# EasyEDA Pro project slimarm_apricot-r_b_v1r3.eprj, board PCB1
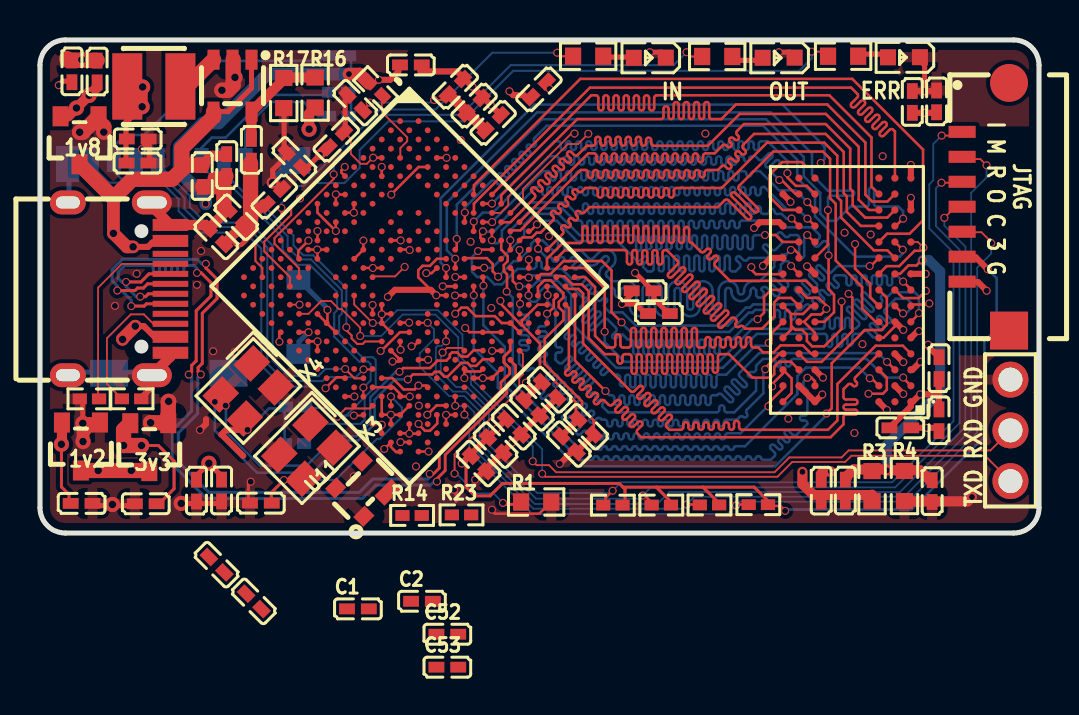
[diagram p1: board, top side]
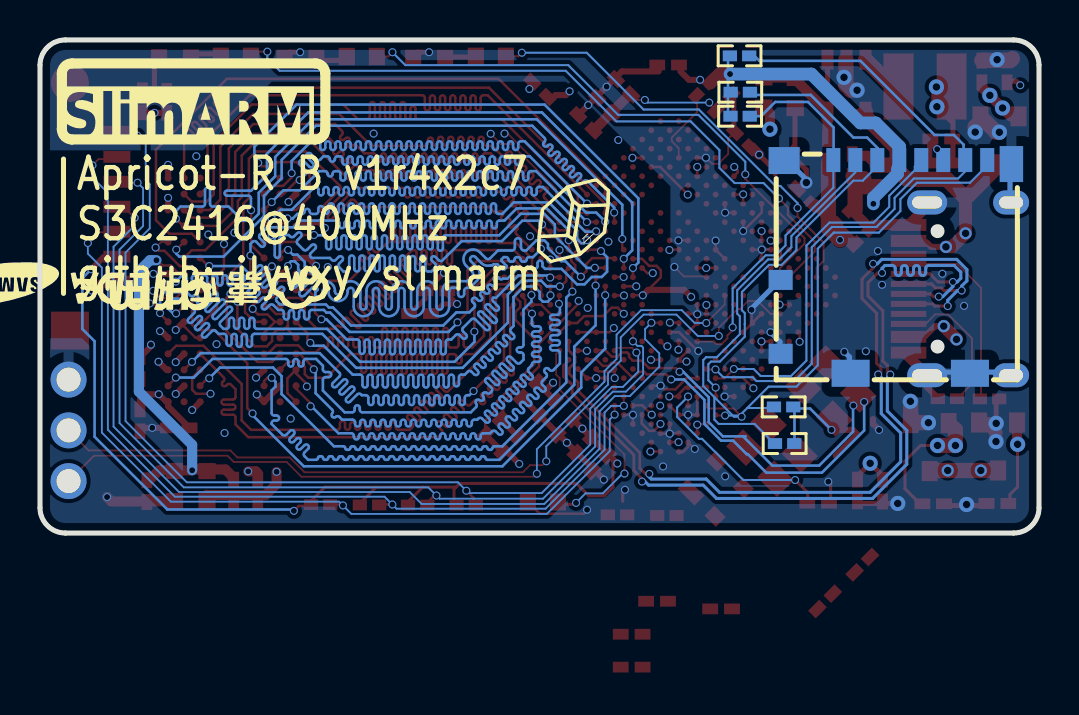
[diagram p2: board, bottom side, seen from below]

Outline 49.98 x 24.69 mm; copper layers: Top Layer, Inner1, Inner2, Bottom Layer. Coordinates in mm from the lower left corner of the outline.
Outline path: 0,23.42 0,1.27 arc(0.37,0.37) 1.27,0 48.71,0 arc(49.61,0.37) 49.98,1.27 49.98,23.42 arc(49.61,24.32) 48.71,24.69 1.27,24.69 arc(0.37,24.32) 0,23.42
Stack: Top Layer 0.035mm / Dielectric1 0.347mm PP er 4.5 / Inner1 0.035mm / Dielectric2 0.347mm FR4 er 4.5 / Inner2 0.035mm / Dielectric3 0.347mm PP er 4.5 / Bottom Layer 0.035mm

## Design rules (mm)
net DDR_CLKN: DDRCLK
net DDR_CLKP: DDRCLK
net USB_DN: USB
net USB_DP: USB
template: 自定义配置
spacing copperThickness1oz (default): track to track 0.089, other pairs 0.089 to 0.3
spacing copperThickness2oz: track to track 0.203, other pairs 0.152 to 0.3
track width copperThickness1oz (default): min 0.089, default 0.089, max 2.54
track width copperThickness2oz: min 0.089, default 0.089, max 2.54
differential pair DDRCLK (default): width min 0.089, default 0.127, max 2.54; gap min 0.203, default 0.203
differential pair USB: width min 0.142, default 0.142, max 2.54; gap min 0.152, default 0.152
via viaSize (default): diameter min 0.399, default 0.399, max 10; hole min 0.3, default 0.3, max 6.299
net DDR_D14 uses DDR
net DDR_D12 uses DDR
net DDR_D6 uses DDR
net DDR_D9 uses DDR
net DDR_D1 uses DDR
net DDR_A14_BA0 uses DDR
net DDR_A10 uses DDR
net DDR_A3 uses DDR
net DDR_A7 uses DDR
net DDR_A12 uses DDR
net DDR_D11 uses DDR
net DDR_D3 uses DDR
net DDR_A15_BA1 uses DDR
net DDR_A1 uses DDR
net DDR_A5 uses DDR
net DDR_A9 uses DDR
net DDR_D10 uses DDR
net DDR_D2 uses DDR
net DDR_A2 uses DDR
net DDR_A6 uses DDR
net DDR_A11 uses DDR
net DDR_D8 uses DDR
net DDR_D0 uses DDR
net DDR_A0 uses DDR
net DDR_A4 uses DDR
net DDR_A8 uses DDR
net DDR_D15 uses DDR
net DDR_D13 uses DDR
net DDR_D7 uses DDR
net DDR_D5 uses DDR
net DDR_RAS uses DDR
net DDR_UDQS uses DDR
net DDR_CS uses DDR
net DDR_CLKN uses DDR
net DDR_WE uses DDR
net DDR_D4 uses DDR
net DDR_LDQS uses DDR
net DDR_UDQM uses DDR
net DDR_SCKE uses DDR
net DDR_LDQM uses DDR
net DDR_CLKP uses DDR
net DDR_CAS uses DDR
net USB_DN uses USB
net USB_DP uses USB
diff pair USB uses USB
eq len grp DDR uses DDR
pour e13763 uses copperRegion1
pour e852 uses copperRegion1
pour e5968 uses copperRegion2

## Placement (name value [footprint] x y rotation side)
C1  13pF  [C0402]  15.91 -3.8 0 top
C2  13pF  [C0402]  19.11 -3.42 0 top
C3  100nF  [C0402]  44.64 2.1 90 top
C4  100nF  [C0402]  40.29 2.13 90 top
C5  100nF  [C0402]  7.83 2.13 270 top
C6  100nF  [C0402]  5.29 1.47 180 top
C9  100nF  [C0402]  1.6 23.12 90 top
C10  100nF  [C0402]  2.86 23.11 90 top
C11  100nF  [C0402]  9.09 2.13 270 top
C12  100nF  [C0402]  2.08 1.49 0 top
C13  100nF  [C0402]  14.83 19.7 45 top
C14  100nF  [C0402]  20.78 22.35 45 top
C15  100nF  [C0402]  11.72 16.84 45 top
C17  100nF  [C0402]  15.77 21.55 135 top
C18  100nF  [C0402]  12.73 18.68 135 top
C19  100nF  [C0402]  9.82 15.81 135 top
C20  100nF  [C0402]  8.82 14.85 135 top
C22  100nF  [C0402]  30.97 10.99 0 top
C23  100nF  [C0402]  30.15 12.13 0 top
C24  100nF  [C0402]  24.97 22.21 45 top
C25  100nF  [C0402]  26.46 4.45 315 top
C26  100nF  [C0402]  27.32 5.32 315 top
C27  100nF  [C0402]  22.67 20.54 45 top
C28  100nF  [C0402]  21.72 21.4 45 top
C30  100nF  [C0402]  21.95 3.48 315 top
C31  100nF  [C0402]  23.7 5.32 315 top
C32  100nF  [C0402]  8.84 -1.58 135 top
C33  100nF  [C0402]  22.8 4.4 315 top
C34  100nF  [C0402]  10.7 -3.42 315 top
C35  100nF  [C0402]  25.5 7.17 315 top
C36  100nF  [C0402]  24.62 6.27 315 top
C37  100nF  [C0402]  43.64 21.58 90 top
C38  100nF  [C0402]  44.86 21.61 90 top
C39  100nF  [C0402]  39.09 2.12 90 top
C40  100nF  [C0402]  43.04 5.27 0 top
C41  100nF  [C0402]  44.98 5.65 270 top
C42  100nF  [C0402]  44.98 8.26 90 top
C43  100nF  [C0402]  18.56 23.44 0 top
C45  100nF  [C0402]  11.05 1.5 180 top
C47  100nF  [C0402]  4.88 18.53 0 top
C48  100nF  [C0402]  4.89 19.73 0 top
C49  100nF  [C0402]  9.34 18.42 270 top
C50  100nF  [C0402]  8.12 17.88 270 top
C51  100nF  [C0402]  10.58 19.19 90 top
C52  13pF  [C0402]  20.38 -5.06 0 top
C53  13pF  [C0402]  20.38 -6.72 0 top
CN1  AFC12-S07DCA-00  [conn-smd_afc12-s07dca-00]  47.55 16.34 90 top
H1  2.54-1*3P针  [hdr-th_3p-p2.54-v-m-1]  48.55 5.14 270 top
L1  2.2uH  [IND-SMD_L3.0-W3.0]  5.7 22.36 180 top
LED1  NCD0603R1  [LED0603-RD_RED]  36.96 23.8 180 top
LED2  NCD0603R1  [LED0603-RD_RED]  30.51 23.8 180 top
LED3  NCD0603R1  [LED0603-RD_RED]  43.22 23.82 180 top
R1  44.2Ω  [R0603]  24.83 1.55 0 top
R3  2kΩ  [R0603]  41.63 2.35 270 top
R4  2kΩ  [R0603]  43.25 2.35 90 top
R5  1kΩ  [R0603]  33.88 23.86 0 top
R6  1kΩ  [R0603]  27.43 23.87 0 top
R7  1kΩ  [R0603]  40.18 23.87 0 top
R8  5.1kΩ  [R0402]  2.47 6.72 0 top
R9  5.1kΩ  [R0402]  4.58 6.72 180 top
R10  10kΩ  [R0402]  28.66 1.4 0 top
R11  10kΩ  [R0402]  33.5 1.41 0 top
R12  10kΩ  [R0402]  31.09 1.4 0 top
R13  5.1kΩ  [R0402]  35.94 1.42 0 top
R14  5.1kΩ  [R0402]  18.62 0.88 0 top
R15  5.1kΩ  [R0402]  16.8 22.25 135 top
R16  44.2Ω  [R0603]  13.77 22.05 90 top
R17  44.2Ω  [R0603]  12.2 22.03 270 top
R18  5.1kΩ  [R0402]  14.94 22.07 0 bottom
R19  5.1kΩ  [R0402]  12.78 6.32 180 bottom
R20  5.1kΩ  [R0402]  14.98 23.89 0 bottom
R21  5.1kΩ  [R0402]  12.73 4.48 180 bottom
R22  5.1kΩ  [R0402]  14.95 20.87 0 bottom
R23  5.1kΩ  [R0402]  21.09 0.91 0 top
SIM1  1040310811  [SIM-SMD_8P-1040310811]  7.15 13.34 0 bottom
U1  S3C2416_SCH  [S3C2416-XH40]  18.48 12.35 315 top
U4  NT5TU32M16FG-AC  [VFBGA-84_L7.5-W12.2-P0.80-TL_NANYA_NT5TU32M16FG]  40.37 12.17 180 top
U6  XC6206-3.3V  [SSOT-3_L2.9-W1.6-P0.95-LS2.8-BR]  5.47 4.3 90 top
U8  XC6206-3.3V  [SSOT-3_L2.9-W1.6-P0.95-LS2.8-BR]  1.98 19.67 90 top
U9  XC6206-3.3V  [SSOT-3_L2.9-W1.6-P0.95-LS2.8-BR]  2.05 4.33 90 top
U10  SY8089AAAC  [SOT-23-5_L3.0-W1.7-P0.95-LS2.8-BR]  9.63 22.4 90 top
U11  MAX811R  [SOT-143R_L2.9-W1.3-P1.92-LS2.3-BL]  16.17 2.22 45 top
USB2  TYPE-C 16PIN 2MD(073)  [USB-C-SMD_TYPE-C-6PIN-2MD-073]  3.77 12.23 270 top
X3  12MHz  [CRYSTAL-SMD_4P-L3.2-W2.5-BL]  13.36 4.1 225 top
X4  12MHz  [CRYSTAL-SMD_4P-L3.2-W2.5-BL]  10.42 7.11 225 top

## Footprints (pads in the part's own frame, mm; a bottom-side part is the same pattern mirrored in y, then rotated)
C0402
  rect 0.79x0.54 smd: 1(-0.545,0) 2(0.545,0)
conn-smd_afc12-s07dca-00
  rect 0.6x1.35 smd: 1(3.75,1.417) 2(2.5,1.417) 3(1.25,1.417) 4(0,1.417) 5(-1.25,1.417) 6(-2.5,1.417) 7(-3.75,1.417)
  rect 1.9x1.9 smd: 8(-6.2,-0.931)
  rrect 1.9x1.9 smd: 9(6.2,-0.931)
CRYSTAL-SMD_4P-L3.2-W2.5-BL
  rect 1.4x1.2 smd: 1(-1.1,-0.85) 2(1.1,-0.85) 3(1.1,0.85) 4(-1.1,0.85)
hdr-th_3p-p2.54-v-m-1
  round 1.8 hole 1.2: 1(-2.54,0) 2(0,0) 3(2.54,0)
IND-SMD_L3.0-W3.0
  rect 1.5x3.32 smd: 1(1.328,0) 2(-1.328,0)
LED0603-RD_RED
  rect 0.8x0.8 smd: 1(-0.799,-0.004) 2(0.799,0.004)
R0402
  rect 0.711x0.54 smd: 1(-0.482,0) 2(0.482,0)
R0603
  rect 0.806x0.864 smd: 1(-0.753,0) 2(0.753,0)
S3C2416-XH40
  round 0.29 smd: A2(-5.525,6.175) A3(-4.875,6.175) A4(-4.225,6.175) A5(-3.575,6.175) A6(-2.925,6.175) A7(-2.275,6.175) A8(-1.625,6.175) A9(-0.975,6.175) A10(-0.325,6.175) A11(0.325,6.175) A12(0.975,6.175) A13(1.625,6.175) A14(2.275,6.175) A15(2.925,6.175) A16(3.575,6.175) A17(4.225,6.175) A18(4.875,6.175) A19(5.525,6.175) B1(-6.175,5.525) B2(-5.525,5.525) B3(-4.875,5.525) B4(-4.225,5.525) B5(-3.575,5.525) B6(-2.925,5.525) B7(-2.275,5.525) B8(-1.625,5.525) B9(-0.975,5.525) B10(-0.325,5.525) B11(0.325,5.525) B12(0.975,5.525) B13(1.625,5.525) B14(2.275,5.525) B15(2.925,5.525) B16(3.575,5.525) B17(4.225,5.525) B18(4.875,5.525) B19(5.525,5.525) B20(6.175,5.525) C1(-6.175,4.875) C2(-5.525,4.875) C3(-4.875,4.875) C4(-4.225,4.875) C5(-3.575,4.875) C6(-2.925,4.875) C7(-2.275,4.875) C8(-1.625,4.875) C9(-0.975,4.875) C10(-0.325,4.875) C11(0.325,4.875) C12(0.975,4.875) C13(1.625,4.875) C14(2.275,4.875) C15(2.925,4.875) C16(3.575,4.875) C17(4.225,4.875) C18(4.875,4.875) C19(5.525,4.875) C20(6.175,4.875) D1(-6.175,4.225) D2(-5.525,4.225) D3(-4.875,4.225) D4(-4.225,4.225) D5(-3.575,4.225) D6(-2.925,4.225) D7(-2.275,4.225) D8(-1.625,4.225) D9(-0.975,4.225) D10(-0.325,4.225) D11(0.325,4.225) D12(0.975,4.225) D13(1.625,4.225) D14(2.275,4.225) D15(2.925,4.225) D16(3.575,4.225) D17(4.225,4.225) D18(4.875,4.225) D19(5.525,4.225) D20(6.175,4.225) E1(-6.175,3.575) E2(-5.525,3.575) E3(-4.875,3.575) E4(-4.225,3.575) E17(4.225,3.575) E18(4.875,3.575) E19(5.525,3.575) E20(6.175,3.575) F1(-6.175,2.925) F2(-5.525,2.925) F3(-4.875,2.925) F4(-4.225,2.925) F7(-2.275,2.925) F8(-1.625,2.925) F9(-0.975,2.925) F10(-0.325,2.925) F11(0.325,2.925) F12(0.975,2.925) F13(1.625,2.925) F14(2.275,2.925) F17(4.225,2.925) F18(4.875,2.925) F19(5.525,2.925) F20(6.175,2.925) G1(-6.175,2.275) G2(-5.525,2.275) G3(-4.875,2.275) G4(-4.225,2.275) G6(-2.925,2.275) G8(-1.625,2.275) G9(-0.975,2.275) G10(-0.325,2.275) G11(0.325,2.275) G12(0.975,2.275) G13(1.625,2.275) G14(2.275,2.275) G15(2.925,2.275) G17(4.225,2.275) G18(4.875,2.275) G19(5.525,2.275) G20(6.175,2.275) H1(-6.175,1.625) H2(-5.525,1.625) H3(-4.875,1.625) H4(-4.225,1.625) H6(-2.925,1.625) H7(-2.275,1.625) H8(-1.625,1.625) H9(-0.975,1.625) H10(-0.325,1.625) H11(0.325,1.625) H12(0.975,1.625) H13(1.625,1.625) H14(2.275,1.625) H15(2.925,1.625) H17(4.225,1.625) H18(4.875,1.625) H19(5.525,1.625) H20(6.175,1.625) J1(-6.175,0.975) J2(-5.525,0.975) J3(-4.875,0.975) J4(-4.225,0.975) J6(-2.925,0.975) J7(-2.275,0.975) J8(-1.625,0.975) J13(1.625,0.975) J14(2.275,0.975) J15(2.925,0.975) J17(4.225,0.975) J18(4.875,0.975) J19(5.525,0.975) J20(6.175,0.975) K1(-6.175,0.325) K2(-5.525,0.325) K3(-4.875,0.325) K4(-4.225,0.325) K6(-2.925,0.325) K7(-2.275,0.325) K8(-1.625,0.325) K13(1.625,0.325) K14(2.275,0.325) K15(2.925,0.325) K17(4.225,0.325) K18(4.875,0.325) K19(5.525,0.325) K20(6.175,0.325) L1(-6.175,-0.325) L2(-5.525,-0.325) L3(-4.875,-0.325) L4(-4.225,-0.325) L6(-2.925,-0.325) L7(-2.275,-0.325) L8(-1.625,-0.325) L13(1.625,-0.325) L14(2.275,-0.325) L15(2.925,-0.325) L17(4.225,-0.325) L18(4.875,-0.325) L19(5.525,-0.325) L20(6.175,-0.325) M1(-6.175,-0.975) M2(-5.525,-0.975) M3(-4.875,-0.975) M4(-4.225,-0.975) M6(-2.925,-0.975) M7(-2.275,-0.975) M8(-1.625,-0.975) M13(1.625,-0.975) M14(2.275,-0.975) M15(2.925,-0.975) M17(4.225,-0.975) M18(4.875,-0.975) M19(5.525,-0.975) M20(6.175,-0.975) N1(-6.175,-1.625) N2(-5.525,-1.625) N3(-4.875,-1.625) N4(-4.225,-1.625) N6(-2.925,-1.625) N7(-2.275,-1.625) N8(-1.625,-1.625) N9(-0.975,-1.625) N10(-0.325,-1.625) N11(0.325,-1.625) N12(0.975,-1.625) N13(1.625,-1.625) N14(2.275,-1.625) N15(2.925,-1.625) N17(4.225,-1.625) N18(4.875,-1.625) N19(5.525,-1.625) N20(6.175,-1.625) P1(-6.175,-2.275) P2(-5.525,-2.275) P3(-4.875,-2.275) P4(-4.225,-2.275) P6(-2.925,-2.275) P7(-2.275,-2.275) P8(-1.625,-2.275) P9(-0.975,-2.275) P10(-0.325,-2.275) P11(0.325,-2.275) P12(0.975,-2.275) P13(1.625,-2.275) P15(2.925,-2.275) P17(4.225,-2.275) P18(4.875,-2.275) P19(5.525,-2.275) P20(6.175,-2.275) R1(-6.175,-2.925) R2(-5.525,-2.925) R3(-4.875,-2.925) R4(-4.225,-2.925) R7(-2.275,-2.925) R8(-1.625,-2.925) R9(-0.975,-2.925) R10(-0.325,-2.925) R11(0.325,-2.925) R12(0.975,-2.925) R13(1.625,-2.925) R14(2.275,-2.925) R17(4.225,-2.925) R18(4.875,-2.925) R19(5.525,-2.925) R20(6.175,-2.925) T1(-6.175,-3.575) T2(-5.525,-3.575) T3(-4.875,-3.575) T4(-4.225,-3.575) T17(4.225,-3.575) T18(4.875,-3.575) T19(5.525,-3.575) T20(6.175,-3.575) U1(-6.175,-4.225) U2(-5.525,-4.225) U3(-4.875,-4.225) U4(-4.225,-4.225) U5(-3.575,-4.225) U6(-2.925,-4.225) U7(-2.275,-4.225) U8(-1.625,-4.225) U9(-0.975,-4.225) U10(-0.325,-4.225) U11(0.325,-4.225) U12(0.975,-4.225) U13(1.625,-4.225) U14(2.275,-4.225) U15(2.925,-4.225) U16(3.575,-4.225) U17(4.225,-4.225) U18(4.875,-4.225) U19(5.525,-4.225) U20(6.175,-4.225) V1(-6.175,-4.875) V2(-5.525,-4.875) V3(-4.875,-4.875) V4(-4.225,-4.875) V5(-3.575,-4.875) V6(-2.925,-4.875) V7(-2.275,-4.875) V8(-1.625,-4.875) V9(-0.975,-4.875) V10(-0.325,-4.875) V11(0.325,-4.875) V12(0.975,-4.875) V13(1.625,-4.875) V14(2.275,-4.875) V15(2.925,-4.875) V16(3.575,-4.875) V17(4.225,-4.875) V18(4.875,-4.875) V19(5.525,-4.875) V20(6.175,-4.875) W1(-6.175,-5.525) W2(-5.525,-5.525) W3(-4.875,-5.525) W4(-4.225,-5.525) W5(-3.575,-5.525) W6(-2.925,-5.525) W7(-2.275,-5.525) W8(-1.625,-5.525) W9(-0.975,-5.525) W10(-0.325,-5.525) W11(0.325,-5.525) W12(0.975,-5.525) W13(1.625,-5.525) W14(2.275,-5.525) W15(2.925,-5.525) W16(3.575,-5.525) W17(4.225,-5.525) W18(4.875,-5.525) W19(5.525,-5.525) W20(6.175,-5.525) Y2(-5.525,-6.175) Y3(-4.875,-6.175) Y4(-4.225,-6.175) Y5(-3.575,-6.175) Y6(-2.925,-6.175) Y7(-2.275,-6.175) Y8(-1.625,-6.175) Y9(-0.975,-6.175) Y10(-0.325,-6.175) Y11(0.325,-6.175) Y12(0.975,-6.175) Y13(1.625,-6.175) Y14(2.275,-6.175) Y15(2.925,-6.175) Y16(3.575,-6.175) Y17(4.225,-6.175) Y18(4.875,-6.175) Y19(5.525,-6.175)
SIM-SMD_8P-1040310811
  rect 0.7x1.2 smd: 1(3.138,-5.338) 2(2.038,-5.338) 3(0.938,-5.338) 4(-0.163,-5.338) 5(-1.262,-5.338) 6(-2.362,-5.338) 7(-3.462,-5.338) 8(-4.562,-5.338)
  rect 1.17x1.8 smd: 9(-5.772,-5.138)
  rect 1.55x1.35 smd: 10(5.598,-5.312)
  rect 1.2x1 smd: 11(5.772,0.662) 12(5.772,4.362)
  rect 1.9x1.35 smd: 13(2.272,5.338) 14(-3.697,5.338)
SOT-23-5_L3.0-W1.7-P0.95-LS2.8-BR
  rect 1x0.6 smd: 1(1.3,-0.95) 2(1.3,0) 3(1.3,0.95) 4(-1.3,0.95) 5(-1.3,-0.95)
SOT-143R_L2.9-W1.3-P1.92-LS2.3-BL
  rect 0.8x0.7 smd: 1(-0.95,-1) 3(0.95,1) 4(-0.95,1)
  rect 1.2x0.7 smd: 2(0.75,-1)
SSOT-3_L2.9-W1.6-P0.95-LS2.8-BR
  rect 1x0.8 smd: 1(1.2,-0.95) 2(1.2,0.95) 3(-1.2,0)
USB-C-SMD_TYPE-C-6PIN-2MD-073
  rect 0.6x1.778 smd: 1(-3.2,2.756) 2(-2.4,2.756) 11(2.4,2.756) 12(3.2,2.756)
  rect 0.3x1.778 smd: 3(-1.75,2.756) 4(-1.25,2.756) 5(-0.75,2.756) 6(-0.25,2.756) 7(0.25,2.756) 8(0.75,2.756) 9(1.25,2.756) 10(1.75,2.756)
  oval 1.2x2 hole 0.6x1.5: 13(-4.325,1.825) 14(4.325,1.825)
  oval 1.2x1.8 hole 0.6x1.2: 13(-4.325,-2.375) 14(4.325,-2.375)
VFBGA-84_L7.5-W12.2-P0.80-TL_NANYA_NT5TU32M16FG
  round 0.36 smd: A1(-3.2,5.6) A2(-2.4,5.6) A3(-1.6,5.6) A7(1.6,5.6) A8(2.4,5.6) A9(3.2,5.6) B1(-3.2,4.8) B2(-2.4,4.8) B3(-1.6,4.8) B7(1.6,4.8) B8(2.4,4.8) B9(3.2,4.8) C1(-3.2,4) C2(-2.4,4) C3(-1.6,4) C7(1.6,4) C8(2.4,4) C9(3.2,4) D1(-3.2,3.2) D2(-2.4,3.2) D3(-1.6,3.2) D7(1.6,3.2) D8(2.4,3.2) D9(3.2,3.2) E1(-3.2,2.4) E2(-2.4,2.4) E3(-1.6,2.4) E7(1.6,2.4) E8(2.4,2.4) E9(3.2,2.4) F1(-3.2,1.6) F2(-2.4,1.6) F3(-1.6,1.6) F7(1.6,1.6) F8(2.4,1.6) F9(3.2,1.6) G1(-3.2,0.8) G2(-2.4,0.8) G3(-1.6,0.8) G7(1.6,0.8) G8(2.4,0.8) G9(3.2,0.8) H1(-3.2,0) H2(-2.4,0) H3(-1.6,0) H7(1.6,0) H8(2.4,0) H9(3.2,0) J1(-3.2,-0.8) J2(-2.4,-0.8) J3(-1.6,-0.8) J7(1.6,-0.8) J8(2.4,-0.8) J9(3.2,-0.8) K2(-2.4,-1.6) K3(-1.6,-1.6) K7(1.6,-1.6) K8(2.4,-1.6) K9(3.2,-1.6) L1(-3.2,-2.4) L2(-2.4,-2.4) L3(-1.6,-2.4) L7(1.6,-2.4) L8(2.4,-2.4) M2(-2.4,-3.2) M3(-1.6,-3.2) M7(1.6,-3.2) M8(2.4,-3.2) M9(3.2,-3.2) N1(-3.2,-4) N2(-2.4,-4) N3(-1.6,-4) N7(1.6,-4) N8(2.4,-4) P2(-2.4,-4.8) P3(-1.6,-4.8) P7(1.6,-4.8) P8(2.4,-4.8) P9(3.2,-4.8) R1(-3.2,-5.6) R2(-2.4,-5.6) R3(-1.6,-5.6) R7(1.6,-5.6) R8(2.4,-5.6)

## Nets
As in the schematic.

Pads without a net: CN1 8 9; U1 A2 A3 A4 A5 A6 A7 A8 A9 B1 B2 B3 B4 B6 B7 B8 B15 B16 C1 C2 C3 C4 C6 C7 C8 C9 D1 D2 D4 D5 D6 D7 D8 D9 D14 D20 E1 E3 E4 E18 E19 E20 F1 F2 F4 F7 F8 F9 F10 F17 F18 F19 F20 G1 G2 G3 G4 G6 G8 G9 G10 G15 G17 G20 H2 H3 H4 H6 H7 H8 H9 H10 H15 H17 J1 J4 J6 J14 J15 J18 K1 K4 K6 K7 K8 K13 K14 K15 K17 L2 L4 L7 L13 L14 L18 M1 M2 M3 M4 M15 M17 M20 N1 N2 N6 N7 N8 N9 N15 N17 N18 N19 N20 P1 P2 P6 P7 P9 P17 R1 R2 R4 R7 R8 R9 R10 R11 R18 T1 T2 T3 T17 T18 U1 U2 U3 U5 U6 U10 U11 U12 U19 U20 V1 V3 V4 V7 V8 V9 V10 V11 V12 W1 W2 W3 W4 W5 W6 W10 W11 W13 Y2 Y3 Y4 Y5 Y7 Y8 Y9 Y10 Y11 Y12 Y14; U4 A2 A8 E2 E8 R3 R7 R8; USB2 3 9

## Via types
v1: diameter 0.4, hole 0.3, Top Layer to Bottom Layer, 202 vias
v2: diameter 0.762, hole 0.381, Top Layer to Bottom Layer, 20 vias
v3: diameter 0.399, hole 0.299, Top Layer to Bottom Layer, 44 vias
v4: diameter 0.61, hole 0.381, Top Layer to Bottom Layer, 7 vias

## Routing (per net, layer and track width the routed paths; a pad name or vN(x,y) marks a point on that pad's centre or on a via; arc(x,y) is an arc through that point)
1V2: length 51.6
  Top Layer w0.127: v1(19.38,5.92) 19.84,6.39 20.31,6.39 20.32,6.38 ; 23.07,9.14 23.06,9.12 v1(22.62,9.12)
  Top Layer w0.152: 1.45,1.41 1.45,1.93 1.08,2.31 1.08,4.44 v2(1.07,4.44)
  Top Layer w0.305: 24.7,7.12 25.12,7.54 C35.1 ; 24.7,7.12 C36.1 ; 24.7,7.12 24.7,7.14 v1(24.31,7.53)
  Top Layer w0.508: v2(1.07,4.44) 1.1,4.47 1.1,5.53
  Inner1 w0.254: v1(19.38,5.92) 19.38,7.76 19,8.14 19,8.91 19.89,9.8 19.89,11.13 20.21,11.46 21.52,11.46 22.12,10.86 22.95,10.86 23.32,10.49 23.32,9.82 v1(22.62,9.12)
  Inner1 w0.305: v1(22.62,9.12) 24.22,7.53 v1(24.31,7.53) 24.31,4.47 22.72,2.88 22.72,2.13 21.6,1.01 10.13,1.01 8.8,2.34 2.19,2.34 1.07,3.46 v2(1.07,4.44)
1V3: length 91.2
  Top Layer w0.089: v3(16.5,21.55) 16.5,21.51 C17.1 ; v3(19.72,21.68) 20.2,21.68 20.48,21.96 ; 12.5,11.43 v1(12.98,11.43)
  Top Layer w0.127: 16.18,13.27 v1(16.65,13.27) 17.1,13.27 ; 15.26,16.95 14.81,16.95 v1(14.8,16.96) 14.8,16.49 ; 18.02,14.19 18.47,14.19 v1(18.5,14.17) ; v1(13.43,14.64) 12.92,14.13 12.92,13.69 ; 20.32,11.89 20.31,11.9 v1(19.82,11.9) ; 18.94,9.6 18.69,9.35 v1(18.59,9.35) ; 19.55,12.18 18.93,12.8 18.93,13.16 19.14,13.38 19.51,13.38 19.86,13.73 20.32,13.73 ; v1(20.78,12.82) 21.23,12.82 21.24,12.81 ; 13.88,9.14 13.88,9.59 v1(13.89,9.6) 13.42,9.6 ; 17.1,5 v1(17.1,5.42) 17.07,5.46 16.64,5.46 ; 16.64,10.97 v1(16.64,11.42) ; 13.88,14.65 v1(13.88,15.12)
  Top Layer w0.254: 4.3,18.47 4.3,20.61 ; 4.34,20.58 v2(5.11,21.34) ; v1(14,18.94) 13.33,18.27 13.25,18.27
  Top Layer w0.305: v1(17.41,11.83) 17.76,12.18 19.55,12.18 v1(19.82,11.9)
  Top Layer w0.508: C14.1 20.48,21.96 22.29,20.15 ; C15.1 11.2,16.46 C20.1 ; v2(5.13,22.33) 5.13,21.37 v2(5.11,21.34) ; R16.1 13.46,21 v2(13.46,20.22) ; v1(14,18.94) 14.37,19.31 C13.1
  Top Layer w0.762: 10.54,18.52 10.54,15.26 v1(9.96,14.68)
  Inner1 w0.127: v1(19.82,11.9) 19.92,12 20.33,12 20.59,12.25 20.59,12.63 v1(20.78,12.82)
  Inner1 w0.152: v1(19.82,11.9) 18.96,11.04 18.96,9.72 v1(18.59,9.35)
  Inner1 w0.254: v1(18.5,14.17) 18.49,14.17 17.84,14.17 17.59,13.93 17.59,13.28 17.12,12.8
  Inner1 w0.305: 14.86,9.6 13.02,11.43 v1(12.98,11.43) ; 14.86,9.6 v1(13.89,9.6) ; 14.86,9.6 15.7,8.75 16.33,8.75 16.66,8.43 16.66,5.87 v1(17.1,5.42) ; v1(14,18.94) 14,17.05 13.88,16.92 v1(13.88,15.12) ; v1(13.88,15.12) 12.99,14.23 ; v1(13.88,15.12) 14.8,16.04 v1(14.8,16.96) ; v1(17.41,11.83) 17,11.42 v1(16.64,11.42)
  Inner1 w0.762: 13.02,11.43 12.99,11.46 12.99,12.98 ; v3(16.5,21.55) 15.17,20.22 v2(13.46,20.22) 13.41,20.28 7.01,20.28 ; 7.01,20.28 6.18,20.28 v2(5.11,21.34) 5.13,21.37 v2(5.13,22.33) ; 7.01,20.28 9.35,17.94 9.35,15.28 v1(9.96,14.68) 12.38,14.68 12.99,14.06 12.99,12.98 ; 12.99,12.98 13.19,12.79 15.97,12.79 16.46,13.27 v1(16.65,13.27) 17.12,12.8 17.12,12.11 v1(17.41,11.83)
  Bottom Layer w0.089: v3(16.5,21.55) 19.59,21.55 v3(19.72,21.68)
1V8: length 203
  Top Layer w0.089: v1(27.43,19.99) 26.92,19.48 26.41,19.48 24.16,17.23 24.16,16.66 23.53,16.03
  Top Layer w0.127: 37.17,9.78 37.58,10.18 37.58,10.38 ; 24.1,10.41 24.11,10.42 24.11,10.64 24.91,11.43 25.37,11.43 ; 24.1,10.41 24.12,10.41 25.02,9.48 25.02,8.34 26.81,6.55 26.81,5.84 26.94,5.71 ; 24.1,10.41 24.09,10.41 23.03,11.5 v1(23.03,11.62) ; v1(44.49,11.5) 44.44,11.44 43.64,11.44 43.57,11.38 ; 21.24,11.89 v1(20.76,11.89) ; 41.97,8.18 42.37,7.78 42.37,7.17 42.17,6.97 v1(41.45,6.97) ; 37.58,10.97 38.17,10.97 38.58,11.38 38.77,11.38 ; 37.58,10.97 37.17,11.38 ; 37.58,10.97 37.58,10.38 ; 41.97,11.38 41.54,11.81 41.54,12.48 40.78,13.24 v1(40.78,14.47) ; v1(40.11,11.59) 40.11,10.22 39.24,9.35 38.63,9.35 38.37,9.61 38.37,9.94 38.13,10.17 37.78,10.17 37.58,10.38 ; 24.45,13.27 24.46,13.28 v1(24.46,13.69) ; 18.02,9.6 18.02,9.2 v1(18.04,9.18) ; v1(18.47,10.54) 18.04,10.54 18.02,10.52 ; v1(36.63,7.34) 36.63,7.45 37.17,8 37.17,8.18 37.61,7.74 37.61,7.01 37.17,6.58 ; v1(35.59,13.32) 35.59,13.19 35.82,12.96 37.16,12.96 37.17,12.98
  Top Layer w0.254: 30.33,10.95 29.81,11.47 v1(29.12,11.47) 29.78,12.13 29.78,12.24
  Top Layer w0.305: C42.1 44.98,6.96 ; 44.98,6.96 C41.1 ; 44.98,6.96 44.97,6.95 v1(44.04,6.95) 43.67,6.58 43.57,6.58 43.57,6.34 C40.1 ; v1(44.05,8.58) 43.65,8.18 43.57,8.18 ; v3(23.49,22.12) 23.68,21.93 24.22,21.93 ; 37.17,15.38 36.98,15.56 36.02,15.56 v1(35.73,15.28) ; C38.1 44.83,21.04 v1(44.25,21.04) C37.1 ; 43.57,12.98 v1(44.31,12.98) ; 38.77,8.18 39.17,7.78 v1(39.17,7.78) ; v1(43.98,10.11) 43.91,10.11 43.57,9.78 ; 26.94,5.71 26.94,5.7 C25.1 ; 43.57,17.78 v1(43.57,18.44)
  Top Layer w0.508: v1(38.15,3.06) 38.15,2.46 38.71,1.9 41.61,1.9 41.63,1.92 ; U8.2 1.41,20.87 v2(1.83,21.28) v2(2.46,21.92) 2.86,22.31 C10.1
  Inner1 w0.089: v1(29.12,11.47) 29.1,11.49 29.1,13.29 28.5,13.89 26.02,13.89 25.45,13.31 24.59,13.31 24.46,13.44
  Inner1 w0.127: 21.28,12.79 22.36,12.79 22.97,12.19 ; 19.54,16 20.13,16.59 21.25,16.59 21.25,16.58 21.8,16.03 22.79,16.03 26.28,19.52 26.85,19.52 27.33,19.99 v1(27.43,19.99) ; v1(24.46,13.69) 24.46,13.44 23.57,12.55 23.15,12.55 22.97,12.37 22.97,12.19 ; 22.97,12.19 22.97,11.63
  Inner1 w0.305: 41.99,12.2 41.99,10.75 41.82,10.58 40.39,10.58 40.11,10.3 ; 41.99,12.2 41.67,12.52 41.46,12.52 40.78,13.2 v1(40.78,14.47) ; 41.99,12.2 42,12.19 42.44,12.19 43.14,11.5 v1(44.49,11.5) ; 22.59,23.37 22.59,23.01 v3(23.49,22.12) ; 17.19,23.37 18.96,21.61 18.96,19.25 19.54,18.66 19.54,15.31 19.86,14.98 ; v1(41.45,6.97) 42.35,6.97 42.99,6.33 43.43,6.33 ; v1(20.76,11.89) 20.8,11.89 21.28,12.38 21.28,13.99 21.07,14.21 20.64,14.21 19.86,14.98 ; 19.86,14.98 19.86,12.75 18.45,11.34 18.45,10.55 v1(18.47,10.54) 18.04,10.11 v1(18.04,9.18) ; v1(39.17,7.78) 39.13,7.78 38.6,8.31 38.12,8.31 ; 38.12,8.31 40.11,10.3 ; 38.12,8.31 37.6,8.31 v1(36.63,7.34) ; v1(35.59,13.32) 35.59,15.14 v1(35.73,15.28) 35.94,15.49 37.2,15.49 39.85,12.83 39.85,11.84 v1(40.11,11.59) 40.11,10.3 ; 43.43,6.33 v1(44.04,6.95) ; 43.43,6.33 41.29,4.2 38.41,4.2 38.15,3.93 v1(38.15,3.06)
  Inner1 w0.508: 44.04,8.62 43.65,9 43.65,9.79 v1(43.98,10.11) 44.19,10.11 44.63,10.55 44.63,11.36 v1(44.49,11.5) ; 44.04,8.62 44.05,8.61 v1(44.05,8.58) ; 44.04,8.62 v1(44.04,6.95) ; 45.21,12.26 44.49,12.98 v1(44.31,12.98)
  Inner1 w0.635: 22.6,23.37 41.95,23.37 44.25,21.06 v1(44.25,21.04)
  Inner1 w0.762: v1(43.57,18.44) 44.08,18.94 44.08,19.72 ; v2(1.83,21.28) v2(2.46,21.92) 4.42,23.88 16.69,23.88 17.19,23.37 17.8,23.98 21.98,23.98 22.59,23.37 ; 44.08,19.72 46.45,17.35 46.45,14.7 45.21,13.45 45.21,11.94 44.63,11.36 ; 44.08,19.72 44.08,20.87 v1(44.25,21.04)
3V3: length 168.5
  Top Layer w0.089: v3(16.96,22.69) 16.85,22.59 R15.2
  Top Layer w0.127: v1(15.25,18.33) 15.08,18.16 15.08,18.05 15.26,17.87 ; v1(11.98,9.58) 11.98,9.99 12.04,10.06 ; 16.64,7.3 17.69,7.3 18.15,6.84 v1(18.5,6.84) ; 15.26,7.76 15.22,7.79 14.84,7.79 v1(14.29,7.25) ; 23.99,10.06 23.53,10.52 23.1,10.52 22.76,10.86 21.81,10.86 21.38,11.28 21.08,11.28 v1(20.78,10.98) ; 19.4,18.33 18.94,18.33 17.58,16.96 v1(17.58,16.94) ; 19.88,5.85 19.88,5.48 19.51,5.12 19.26,5.12 18.94,5.44 v1(18.94,5.46) ; 36.62,1.36 37.03,1.36 v1(37.28,1.11) ; v1(17.64,8.59) 17.93,8.59 18.02,8.68 17.56,9.14 ; v1(21.23,7.76) 21.23,8.09 22.03,8.09 22.16,8.21 ; v1(18.04,4.55) 18.46,4.55 18.48,4.54 ; 17.1,17.87 v1(17.1,18.33) ; 18.94,4.08 v1(19.44,4.08)
  Top Layer w0.152: 5.94,1.45 6.71,2.22 6.71,3.6 5.93,4.38 v2(5.08,4.38) ; 33.17,2.3 30.83,2.3 ; 33.17,2.3 34.04,1.43 ; 33.17,2.3 35.73,2.3 36.59,1.45 ; 30.83,2.3 29.17,2.3 ; 30.83,2.3 31.69,1.45 ; 29.27,1.38 29.27,2.2 29.17,2.3 ; 29.17,2.3 28.98,2.48 23.14,2.48 22.52,1.86 21.75,1.86 21.32,2.3 21.32,3.7
  Top Layer w0.305: 46.29,13.81 46.81,13.81 v1(47.42,13.21) ; 10.17,3.86 9.1,4.93 9.08,4.93 9.31,5.17 v1(10.38,5.17) ; v3(16.96,22.69) 17.52,22.69 17.94,23.11 ; C31.1 v1(22.85,5.23) v1(21.1,3.48)
  Top Layer w0.635: v3(15.46,22.98) 15.99,22.98 16.45,22.52
  Top Layer w0.762: U6.2 4.18,5.16 v2(4.18,4.38) v2(5.08,4.38)
  Inner1 w0.089: v1(21.23,7.76) 20.78,8.21 v1(20.78,10.98)
  Inner1 w0.254: v1(18.04,4.55) 18.04,3.34 19.81,1.56 20.87,1.56 21.2,1.88 21.2,3.39 v1(21.1,3.48) v1(22.85,5.23) ; v1(21.23,7.76) 19.86,6.39 19.86,5.65 19.67,5.46 v1(18.94,5.46) ; v1(15.25,18.33) 15.09,18.18 15.31,18.18 15.45,18.33 15.84,18.33 16.36,17.81 16.36,17.47 16.89,16.94 v1(17.58,16.94) 18.95,15.57 18.95,13.44 18.69,13.18 18.69,12.26 18.53,12.09 18.52,12.09 18.03,11.6 18.03,11.19 17.45,10.62 17.45,9.18 17.64,9 v1(17.64,8.59)
  Inner1 w0.305: v1(18.94,5.46) 18.94,5.58 18.5,6.02 v1(18.5,6.84) 18.18,6.84 17.3,7.72 17.3,8.25 v1(17.64,8.59) ; v1(14.29,7.25) 14.8,6.74 15.03,6.74 ; 15.03,6.74 13.24,8.53 13.02,8.53 v1(11.98,9.58) ; 15.03,6.74 15.03,5.83 16.06,4.8 17.79,4.8 v1(18.04,4.55) 18.39,4.2 19.32,4.2 v1(19.44,4.08)
  Inner1 w0.635: 17.58,18.16 v1(17.58,16.94) ; 17.58,18.16 17.58,21.81 16.4,22.98 v3(15.46,22.98) ; 17.58,18.16 17.4,18.33 v1(17.1,18.33)
  Inner1 w0.762: 11.54,9.29 10.38,8.13 v1(10.38,5.17) 9.6,4.38 v2(5.08,4.38) 4.28,4.38 4.27,4.38 ; 11.54,9.29 11.54,11.59 8.32,14.81 8.32,16.46 ; 11.54,9.29 11.83,9.58 v1(11.98,9.58)
  Bottom Layer w0.127: 12.23,6.18 12.23,4.51 12.17,4.44 ; v1(10.38,5.17) 11.46,6.24 12.26,6.24 ; v1(47.42,13.21) 47.87,12.76 47.87,10.22 47.25,9.6 47.25,4.82 43.61,1.18 37.37,1.18 37.33,1.14 ; 15.46,20.73 15.56,20.83 15.56,23.94
  Bottom Layer w0.635: 7.08,18.24 7.08,17.99 8.29,16.78 v3(8.29,16.48) ; 6.98,18.38 6.98,19.34 8.16,20.53 8.94,20.53 11.39,22.98 v3(15.46,22.98)
5V: length 60.5
  Top Layer w0.254: 9.04,2.85 9.04,2.9 v2(8.45,3.49) 7.86,2.9 7.86,2.74 ; 1.6,22.63 1.14,22.63 v3(0.94,22.42) ; U10.1 10.58,22.28 9.41,21.1 U10.4
  Top Layer w0.305: USB2.11 6.47,9.77 5.79,9.77 5.2,10.36 v4(4.77,10.36) ; USB2.2 6.44,14.54 5.62,14.54 5.4,14.33 v4(4.66,14.33)
  Top Layer w0.508: 9.34,19.08 9.14,18.89 8.58,18.89 C50.1
  Top Layer w0.635: v4(4.66,14.33) 4.35,14.33 v4(3.67,15.01) 3.67,16.77 ; v4(4.13,9.7) 4.13,9.72 v4(4.77,10.36)
  Top Layer w0.762: C50.1 7.32,18.42 7.1,18.2 ; 7.1,18.2 6.61,17.71 4.61,17.71 3.67,16.77 U8.3 ; 7.1,18.2 7.1,19.26 8.68,20.84 U10.4 ; U6.3 5.44,3.13 v4(4.57,3.13) v4(2.91,3.13) 2.05,3.13
  Inner1 w0.254: v4(3.67,15.01) 3.67,16.48 1.14,19.01 1.14,22.22 v3(0.94,22.42)
  Inner1 w0.635: v4(3.67,15.01) 4.35,14.33 4.63,14.33
  Inner1 w0.762: v4(4.13,9.7) 4.05,9.7 2.4,11.34 2.4,13.73 v4(3.67,15.01) ; v4(4.13,9.7) 4.13,9.72 v4(4.77,10.36) ; v4(4.13,9.7) 3.28,8.85 3.28,3.5 v4(2.91,3.13) v4(4.57,3.13) 8.09,3.13 v2(8.45,3.49)
  Bottom Layer w0.254: 0.92,22.38 0.94,22.4 v3(0.94,22.42)
GND: length 152.5
  Top Layer w0.089: 16.66,18.79 16.35,18.49 16.04,18.49 15.55,18.98 15.55,19.74 15.21,20.08 ; v1(44.2,14.29) 43.92,14.57 U4.L1 ; 22.62,16.03 23.04,16.03 23.43,16.42 23.43,16.85 26.58,20 v1(26.74,20) ; 16.64,12.81 16.6,12.85 17.77,12.85 v1(18.24,13.32) ; 37.97,10.58 38.22,10.58
  Top Layer w0.127: 38.77,9.78 38.77,10.02 38.22,10.58 38.23,10.58 38.6,10.94 39.07,10.94 39.34,11.21 ; v1(14.38,11.17) 14.38,10.56 14.34,10.52 ; v1(20.15,12.35) 20.78,12.35 ; 18.94,5 18.91,4.98 v1(18.48,4.98) ; v1(17.1,10.95) 17.1,10.52 17.56,10.06 ; v1(17.1,10.95) 17.12,10.97 17.56,10.97 ; v1(17.1,10.95) 17.1,11.43 ; v1(13.87,14.19) 13.42,14.19 ; v1(13.87,14.19) 13.88,14.18 13.88,13.73 ; v1(13.87,14.19) 14.34,14.19 14.35,14.18 ; v1(40.45,11.98) 40.64,11.79 40.64,10.11 39.11,8.57 38.38,8.57 37.97,8.98 ; 15.26,6.84 v1(15.73,6.84) ; 14.34,10.52 14.8,10.06 ; 14.34,10.52 13.88,10.97 ; U1.M6 U1.L6 v1(16.18,14.64) ; C26.2 27.71,5.63 27.12,6.23 27.12,6.59 25.25,8.46 25.25,9.72 26.19,10.66 26.19,11.07 25.96,11.31 25.96,11.57 26.18,11.8 26.18,12.02 25.54,12.66 25.24,12.66 24.91,12.33 24.91,11.89 ; v1(18.48,4.98) 18.45,5 18.02,5 ; v1(18.48,4.98) 18.48,5.46 ; 23.07,10.06 21.48,10.06 v1(21.27,10.27) ; 22.61,1.12 22.77,0.97 24.98,0.97 25.45,1.44 25.45,1.47 ; 18.02,5.92 U1.U17 ; v3(17.22,4.21) 17.23,4.21 U1.Y18 17.56,4.31 17.82,4.06 18,4.06 18.02,4.08 ; 15.26,16.03 15.27,16.04 v1(15.71,16.04) 15.71,16.48 15.72,16.49 ; 17.56,5.46 17.56,5.92 ; 17.56,5.92 v1(17.56,5.92) 17.1,5.92 17.1,5.92 17.1,6.84 ; 17.56,5.92 18.02,5.92 ; v1(44.32,12.13) 43.96,11.76 43.18,11.76 42.77,12.18 ; 17.1,18.79 17.09,18.79 v1(16.67,18.79) ; 12.96,10.06 v1(13.44,10.06) ; 18.48,10.06 18.01,10.06 17.07,9.12 v1(17.04,9.12) ; 19.86,13.27 19.6,13.01 v1(19.33,13.01) ; 17.56,14.65 v1(18.04,14.65) ; 14.8,15.57 v1(14.8,15.12) 13.88,16.04 U1.L1 ; 23.07,8.22 22.62,7.76 21.7,7.76 21.7,7.76 v1(22.16,7.76) ; 19.86,18.79 v1(20.34,18.79) ; 18.94,8.68 v1(19.42,8.68) ; 41.97,12.98 42.36,13.36 42.99,13.36 43.76,14.13 44.04,14.13 v1(44.2,14.29) ; v1(23.99,14.17) 23.99,13.74 23.99,13.73 ; 19.4,7.3 19.31,7.38 v1(18.94,7.38) 18.74,7.19 18.2,7.19 17.63,7.76 17.1,7.76 ; 37.97,12.18 38.37,11.78 38.96,11.78 39.34,11.39 v1(39.34,11.22) ; 20.78,5.92 v1(20.32,5.92) 20.32,5.46 ; 41.97,9.78 42.2,9.78 42.77,10.35 42.77,10.58
  Top Layer w0.152: 20.83,1.59 20.83,2.06 v1(20.72,2.17) ; 10.42,1.66 10.42,2.45 v1(10.54,2.57)
  Top Layer w0.254: 5.23,19.57 5.23,19.36 v3(5.1,19.22) ; 9.2,1.57 9.11,1.48 v2(7.07,1.48) ; v1(29.77,13.03) 30.62,12.18 30.62,12.14 ; 12.22,21.07 12.22,19.19 12.45,18.95 ; v4(11.64,17.55) 11.64,18.18 12.42,18.96 ; 30.72,12.05 30.72,11.73 31.51,10.94 ; 4.74,1.43 4.68,1.38 2.62,1.38 ; 2.1,6.63 2.14,6.59 v2(2.14,5.49) ; 43.98,23.7 44.26,23.42 v1(44.26,22.13) ; 31.15,24.02 31.1,24.08 v3(30.52,24.08) ; 15.27,20.16 15.27,21.94 ; 5.47,18.47 5.47,19.68 ; 37.7,23.89 37.51,24.08 v3(36.97,24.08)
  Top Layer w0.305: C35.2 v1(23.62,4.52) v1(21.77,2.67) ; 46.29,12.56 46.93,12.56 v1(47.37,12.13) ; C40.2 v1(44.37,5.27) 44.81,5.27 C41.2 ; 42.77,8.98 43.19,8.56 ; v4(11.64,17.55) 11.79,17.55 12.11,17.23 ; 8.31,5.7 8.31,5.46 v1(8,5.16) ; 19.03,23.11 20.87,23.11 v3(21.63,22.35) v3(22.56,21.43) C27.2 ; v1(37.55,16.58) 37.55,16.6 37.17,16.98 ; C26.2 27.71,4.93 C25.2 26.61,4.07 v1(26.01,3.46) ; v1(44.43,9.43) 44.43,9.35 C42.2 ; 5.01,6.72 5.6,7.3 USB2.14 ; 41.97,6.58 41.97,6.56 v1(42.37,6.16) ; 43.57,16.18 v1(43.57,16.78) ; C37.2 v1(44.26,22.13) 44.83,22.13 C38.2 ; 38.77,6.58 37.97,7.38 ; v1(36.17,13.38) 36.57,13.78 37.17,13.78 ; v1(43.19,6.96) 43.19,6.96 42.77,7.38 ; v1(38.38,13.36) 38.39,13.36 38.77,12.98 ; 42.77,10.58 42.79,10.58 v1(43.19,10.17) ; 38.78,6.58 v1(39.14,6.94)
  Top Layer w0.508: v1(39.56,3.09) 39.19,3.09 39.09,2.99 ; USB2.12 6.53,8.83 USB2.14 ; C19.2 9.4,16.2 C20.2 8.25,15.43 USB2.1 5.6,16.36 USB2.13 ; v1(46.63,1.8) 46.41,1.59 43.16,1.59
  Top Layer w0.635: v2(2.14,5.49) 2.59,5.49 ; 2.59,5.49 2.15,5.06 v2(2.15,4.58) ; 2.59,5.49 2.96,5.49 U9.1
  Top Layer w0.762: 8.15,17.34 8.78,17.34 8.97,17.54 ; 2.86,23.67 1.42,23.67 1.33,23.75 ; v2(6.44,6.59) 6.42,6.57 U6.1 6.39,5.52 v2(5.53,5.52) ; v2(9.1,22.17) 9.41,22.17 9.66,22.43 9.66,23.71 ; 8.97,17.54 9.2,17.31 9.2,16.16 ; 8.97,17.54 9.3,17.87 ; 8.97,17.54 8.77,17.75 ; 2.81,20.72 3.19,20.34 v2(3.19,20.07) ; v2(1.98,20.07) 2.14,20.07 2.81,20.74
  Bottom Layer w0.254: 5.7,7.95 5.59,8.06 1.47,8.06 ; v4(11.64,17.55) 11.64,17.7 12.57,18.62 ; v1(9.74,9.08) 9.48,8.81 9.48,7.91 ; 1.45,18.31 1.45,16.91 ; 13.16,12.47 14.38,11.24 v1(14.38,11.17) ; 12.96,8.83 12.96,9.58 v1(13.44,10.06)
  vias: v1(3.75,11.37) v1(4.84,12.98) v1(7.85,12.43) v1(8.06,14.12) v1(8.66,9.1) v1(15.7,2.84) v1(18.81,3.33) v1(21.54,14.58) v1(22.58,11.27) v1(22.61,1.17) v1(25.47,14.86) v1(33.29,20) v1(37.44,5.73) v1(40.26,15.04) v1(40.75,5.01) v1(41.15,9.46) v1(41.56,14.95) v1(42.16,18.87) v1(43.19,8.56) v2(2.1,23.7) v2(3.62,1.43) v2(9.76,22.81) v3(21.05,19.68) v3(25.5,22.23)
DDR_A0: length 32.8
  Top Layer w0.127: 22.62,15.11 22.65,15.08 22.61,15.04 v1(22.61,14.66) ; v1(37.6,15.75) 37.6,15.75 37.97,15.38
  Bottom Layer w0.127: v1(37.6,15.75) 37.34,15.75 37.11,15.98 36.87,15.98 arc(36.78,16.01) 36.74,16.1 arc(36.62,16.23) 36.49,16.1 arc(36.45,16.01) 36.36,15.98 36.18,15.98 arc(36.09,16.01) 36.06,16.1 36.06,16.25 arc(35.93,16.37) 35.8,16.25 35.8,16.1 arc(35.68,15.98) 35.55,16.1 35.55,16.38 arc(35.42,16.51) 35.3,16.38 35.3,16.1 arc(35.17,15.98) 35.04,16.1 35.04,16.38 arc(34.91,16.51) 34.79,16.38 34.79,16.1 arc(34.66,15.98) 34.53,16.1 34.53,16.38 arc(34.41,16.51) 34.28,16.38 34.28,16.1 arc(34.15,15.98) 34.03,16.1 34.03,16.38 arc(33.9,16.51) 33.77,16.38 33.77,16.1 arc(33.64,15.98) 33.52,16.1 33.52,16.38 arc(33.39,16.51) 33.26,16.38 33.26,16.1 arc(33.14,15.98) 33.01,16.1 33.01,16.38 arc(32.88,16.51) 32.76,16.38 32.76,16.1 arc(32.63,15.98) 32.5,16.1 32.5,16.38 arc(32.37,16.51) 32.25,16.38 32.25,16.1 arc(32.12,15.98) 31.99,16.1 31.99,16.38 arc(31.87,16.51) 31.74,16.38 31.74,16.1 arc(31.61,15.98) 31.49,16.1 31.49,16.38 arc(31.36,16.51) 31.23,16.38 31.23,16.1 arc(31.1,15.98) 30.98,16.1 30.98,16.38 arc(30.85,16.51) 30.72,16.38 30.72,16.1 arc(30.6,15.98) 30.47,16.1 30.47,16.38 arc(30.34,16.51) 30.22,16.38 30.22,16.1 arc(30.09,15.98) 29.96,16.1 29.96,16.38 arc(29.83,16.51) 29.71,16.38 29.71,16.1 arc(29.58,15.98) 29.45,16.1 29.45,16.38 arc(29.33,16.51) 29.2,16.38 29.2,16.1 arc(29.07,15.98) 28.95,16.1 28.95,16.38 arc(28.82,16.51) 28.69,16.38 28.69,16.1 arc(28.56,15.98) 28.44,16.1 28.44,16.38 arc(28.31,16.51) 28.18,16.38 28.18,16.1 arc(28.06,15.98) 27.93,16.1 27.93,16.38 arc(27.8,16.51) 27.68,16.38 27.68,16.1 arc(27.55,15.98) 27.42,16.1 27.42,16.38 arc(27.29,16.51) 27.17,16.38 27.17,16.1 arc(27.13,16.01) 27.04,15.98 26.86,15.98 26.28,16.56 24.52,16.56 23.11,15.14 23.11,14.72 22.9,14.51 22.76,14.51 v1(22.61,14.66)
DDR_A1: length 32.8
  Top Layer w0.127: 41.97,15.38 41.07,15.38 40.37,16.08 40.37,16.86 40.21,17.01 40.21,19.08 39.31,19.98 35.73,19.98 35.18,19.44 arc(35.15,19.35) 35.18,19.26 35.28,19.16 arc(35.28,18.98) 35.1,18.98 35,19.08 arc(34.82,19.08) 34.82,18.9 34.92,18.81 arc(34.92,18.63) 34.74,18.63 34.64,18.72 arc(34.46,18.72) 34.46,18.54 34.56,18.45 arc(34.56,18.27) 34.38,18.27 34.28,18.36 arc(34.19,18.4) 34.1,18.36 33.92,18.18 33.39,18.18 arc(33.3,18.14) 33.26,18.05 33.26,17.94 arc(33.13,17.81) 33,17.94 33,18.05 arc(32.88,18.18) 32.75,18.05 32.75,17.9 arc(32.62,17.77) 32.5,17.9 32.5,18.05 arc(32.37,18.18) 32.24,18.05 32.24,17.9 arc(32.12,17.77) 31.99,17.9 31.99,18.05 arc(31.86,18.18) 31.73,18.05 31.73,17.9 arc(31.61,17.77) 31.48,17.9 31.48,18.05 arc(31.35,18.18) 31.23,18.05 31.23,17.9 arc(31.1,17.77) 30.97,17.9 30.97,18.05 arc(30.85,18.18) 30.72,18.05 30.72,17.9 arc(30.59,17.77) 30.47,17.9 30.47,18.05 arc(30.34,18.18) 30.21,18.05 30.21,17.9 arc(30.08,17.77) 29.96,17.9 29.96,18.05 arc(29.83,18.18) 29.7,18.05 29.7,17.9 arc(29.58,17.77) 29.45,17.9 29.45,18.05 arc(29.32,18.18) 29.19,18.05 29.19,17.9 arc(29.07,17.77) 28.94,17.9 28.94,18.05 arc(28.81,18.18) 28.69,18.05 28.69,17.9 arc(28.56,17.77) 28.43,17.9 28.43,18.05 arc(28.31,18.18) 28.18,18.05 28.18,17.9 arc(28.05,17.77) 27.93,17.9 27.93,18.05 arc(27.8,18.18) 27.67,18.05 27.67,17.9 arc(27.54,17.77) 27.42,17.9 27.42,18.05 arc(27.38,18.14) 27.29,18.18 27.06,18.18 24.03,15.16 23.58,15.16 23.53,15.11
DDR_A2: length 32.9
  Top Layer w0.127: v1(38.4,15.74) 38.41,15.74 38.77,15.38 ; v1(22.16,15.11) 22.04,14.99 22.04,14.77 22.16,14.65
  Bottom Layer w0.127: v1(22.16,15.11) 22.18,15.09 22.69,15.09 23.17,15.56 23.17,15.67 24.83,17.33 25,17.33 arc(25.09,17.29) 25.13,17.2 25.13,17.03 arc(25.26,16.9) 25.39,17.03 25.39,17.2 arc(25.51,17.33) 25.64,17.2 25.64,17.03 arc(25.77,16.9) 25.89,17.03 25.89,17.2 arc(26.02,17.33) 26.15,17.2 26.15,17.03 arc(26.28,16.9) 26.4,17.03 26.4,17.2 arc(26.53,17.33) 26.66,17.2 26.66,17.03 arc(26.78,16.9) 26.91,17.03 26.91,17.2 arc(27.04,17.33) 27.16,17.2 27.16,17.03 arc(27.29,16.9) 27.42,17.03 27.42,17.2 arc(27.54,17.33) 27.67,17.2 27.67,17.03 arc(27.8,16.9) 27.93,17.03 27.93,17.2 arc(28.05,17.33) 28.18,17.2 28.18,17.03 arc(28.31,16.9) 28.43,17.03 28.43,17.2 arc(28.56,17.33) 28.69,17.2 28.69,17.03 arc(28.81,16.9) 28.94,17.03 28.94,17.2 arc(29.07,17.33) 29.2,17.2 29.2,17.03 arc(29.32,16.9) 29.45,17.03 29.45,17.2 arc(29.58,17.33) 29.7,17.2 29.7,17.03 arc(29.83,16.9) 29.96,17.03 29.96,17.2 arc(30.09,17.33) 30.21,17.2 30.21,17.03 arc(30.34,16.9) 30.47,17.03 30.47,17.2 arc(30.59,17.33) 30.72,17.2 30.72,17.03 arc(30.85,16.9) 30.97,17.03 30.97,17.2 arc(31.1,17.33) 31.23,17.2 31.23,17.03 arc(31.35,16.9) 31.48,17.03 31.48,17.2 arc(31.61,17.33) 31.74,17.2 31.74,17.03 arc(31.86,16.9) 31.99,17.03 31.99,17.2 arc(32.12,17.33) 32.24,17.2 32.24,17.03 arc(32.37,16.9) 32.5,17.03 32.5,17.2 arc(32.62,17.33) 32.75,17.2 32.75,17.03 arc(32.88,16.9) 33.01,17.03 33.01,17.2 arc(33.13,17.33) 33.26,17.2 33.26,17.03 arc(33.39,16.9) 33.51,17.03 33.51,17.2 arc(33.64,17.33) 33.77,17.2 33.77,17.03 arc(33.9,16.9) 34.02,17.03 34.02,17.2 arc(34.15,17.33) 34.28,17.2 34.28,17.03 arc(34.4,16.9) 34.53,17.03 34.53,17.2 arc(34.66,17.33) 34.78,17.2 34.78,17.03 arc(34.91,16.9) 35.04,17.03 35.04,17.2 arc(35.16,17.33) 35.29,17.2 35.29,17.03 arc(35.42,16.9) 35.55,17.03 35.55,17.2 arc(35.67,17.33) 35.8,17.2 35.8,17.03 arc(35.93,16.9) 36.05,17.03 36.05,17.2 arc(36.09,17.29) 36.18,17.33 36.24,17.33 37.38,16.19 37.95,16.19 v1(38.4,15.74)
DDR_A3: length 32.8
  Top Layer w0.127: 23.99,15.57 27.43,19.01 27.72,19.01 arc(27.81,18.97) 27.84,18.88 27.84,18.69 arc(27.97,18.56) 28.1,18.69 28.1,18.88 arc(28.22,19.01) 28.35,18.88 28.35,18.69 arc(28.48,18.56) 28.61,18.69 28.61,18.88 arc(28.73,19.01) 28.86,18.88 28.86,18.69 arc(28.99,18.56) 29.11,18.69 29.11,18.88 arc(29.24,19.01) 29.37,18.88 29.37,18.69 arc(29.49,18.56) 29.62,18.69 29.62,18.88 arc(29.75,19.01) 29.88,18.88 29.88,18.69 arc(30,18.56) 30.13,18.69 30.13,18.88 arc(30.26,19.01) 30.38,18.88 30.38,18.69 arc(30.51,18.56) 30.64,18.69 30.64,18.88 arc(30.76,19.01) 30.89,18.88 30.89,18.69 arc(31.02,18.56) 31.15,18.69 31.15,18.88 arc(31.27,19.01) 31.4,18.88 31.4,18.69 arc(31.53,18.56) 31.65,18.69 31.65,18.88 arc(31.78,19.01) 31.91,18.88 31.91,18.69 arc(32.03,18.56) 32.16,18.69 32.16,18.88 arc(32.29,19.01) 32.42,18.88 32.42,18.69 arc(32.54,18.56) 32.67,18.69 32.67,18.88 arc(32.8,19.01) 32.92,18.88 32.92,18.69 arc(33.05,18.56) 33.18,18.69 33.18,18.88 arc(33.21,18.97) 33.3,19.01 33.76,19.01 34.15,19.41 arc(34.24,19.45) 34.33,19.41 34.39,19.35 arc(34.57,19.35) 34.57,19.53 34.51,19.59 arc(34.51,19.77) 34.69,19.77 34.75,19.71 arc(34.93,19.71) 34.93,19.89 34.87,19.95 arc(34.84,20.04) 34.87,20.13 35.22,20.48 39.31,20.48 40.53,19.26 40.53,17.23 40.66,17.11 40.66,16.42 41.29,15.79 42.39,15.79 42.77,16.18
DDR_A4: length 32.8
  Top Layer w0.127: 37.97,16.18 37.16,16.18 36.49,16.84 36.49,17.92 37.14,18.57 38.11,18.57 38.31,18.37 38.9,18.37 v1(39.06,18.53) ; 20.32,12.81 v1(20.32,13.27)
  Bottom Layer w0.127: v1(20.32,13.27) 20.05,13.54 20.05,16.76 24.74,21.45 37.15,21.45 39.26,19.34 39.26,18.72 v1(39.06,18.53)
DDR_A5: length 32.8
  Top Layer w0.127: 41.97,16.18 41.48,16.18 40.96,16.69 40.96,19.34 39.32,20.99 35.01,20.99 33.42,19.39 30.7,19.39 arc(30.61,19.43) 30.58,19.52 30.58,19.67 arc(30.45,19.8) 30.32,19.67 30.32,19.52 arc(30.2,19.39) 30.07,19.52 30.07,19.72 arc(29.94,19.84) 29.81,19.72 29.81,19.52 arc(29.69,19.39) 29.56,19.52 29.56,19.72 arc(29.43,19.84) 29.31,19.72 29.31,19.52 arc(29.18,19.39) 29.05,19.52 29.05,19.72 arc(28.93,19.84) 28.8,19.72 28.8,19.52 arc(28.67,19.39) 28.54,19.52 28.54,19.72 arc(28.42,19.84) 28.29,19.72 28.29,19.52 arc(28.16,19.39) 28.04,19.52 28.04,19.72 arc(27.91,19.84) 27.78,19.72 27.78,19.52 arc(27.75,19.43) 27.66,19.39 27.36,19.39 26.9,18.93 arc(26.81,18.9) 26.72,18.93 26.58,19.07 arc(26.4,19.07) 26.4,18.89 26.54,18.75 arc(26.54,18.57) 26.36,18.57 26.22,18.71 arc(26.05,18.71) 26.04,18.53 26.19,18.39 arc(26.18,18.21) 26.01,18.21 25.87,18.35 arc(25.69,18.35) 25.69,18.17 25.83,18.03 arc(25.83,17.86) 25.65,17.86 25.51,18 arc(25.33,18) 25.33,17.82 25.47,17.68 arc(25.47,17.5) 25.29,17.5 25.15,17.64 arc(24.97,17.64) 24.97,17.46 25.11,17.32 arc(25.11,17.14) 24.93,17.14 24.79,17.28 arc(24.61,17.28) 24.61,17.1 24.75,16.96 arc(24.79,16.87) 24.75,16.78 23.53,15.56 23.08,15.56 23.07,15.57
DDR_A6: length 32.8
  Top Layer w0.127: v1(38.39,16.57) 38.39,16.56 38.77,16.18 ; v1(22.62,15.57) 22.16,15.57
  Bottom Layer w0.127: v1(22.62,15.57) 22.62,15.58 25.16,18.12 25.43,18.12 arc(25.52,18.08) 25.55,17.99 25.55,17.77 arc(25.68,17.64) 25.81,17.77 25.81,17.99 arc(25.94,18.12) 26.06,17.99 26.06,17.77 arc(26.19,17.64) 26.32,17.77 26.32,17.99 arc(26.44,18.12) 26.57,17.99 26.57,17.77 arc(26.7,17.64) 26.82,17.77 26.82,17.99 arc(26.95,18.12) 27.08,17.99 27.08,17.77 arc(27.21,17.64) 27.33,17.77 27.33,17.99 arc(27.46,18.12) 27.59,17.99 27.59,17.77 arc(27.71,17.64) 27.84,17.77 27.84,17.99 arc(27.97,18.12) 28.09,17.99 28.09,17.77 arc(28.22,17.64) 28.35,17.77 28.35,17.99 arc(28.48,18.12) 28.6,17.99 28.6,17.77 arc(28.73,17.64) 28.86,17.77 28.86,17.99 arc(28.98,18.12) 29.11,17.99 29.11,17.77 arc(29.24,17.64) 29.36,17.77 29.36,17.99 arc(29.49,18.12) 29.62,17.99 29.62,17.77 arc(29.75,17.64) 29.87,17.77 29.87,17.99 arc(30,18.12) 30.13,17.99 30.13,17.77 arc(30.25,17.64) 30.38,17.77 30.38,17.99 arc(30.51,18.12) 30.63,17.99 30.63,17.77 arc(30.76,17.64) 30.89,17.77 30.89,17.99 arc(31.02,18.12) 31.14,17.99 31.14,17.77 arc(31.27,17.64) 31.4,17.77 31.4,17.99 arc(31.52,18.12) 31.65,17.99 31.65,17.77 arc(31.78,17.64) 31.9,17.77 31.9,17.99 arc(32.03,18.12) 32.16,17.99 32.16,17.77 arc(32.29,17.64) 32.41,17.77 32.41,17.99 arc(32.54,18.12) 32.67,17.99 32.67,17.77 arc(32.79,17.64) 32.92,17.77 32.92,17.99 arc(33.05,18.12) 33.17,17.99 33.17,17.77 arc(33.3,17.64) 33.43,17.77 33.43,17.99 arc(33.56,18.12) 33.68,17.99 33.68,17.77 arc(33.81,17.64) 33.94,17.77 33.94,17.99 arc(34.06,18.12) 34.19,17.99 34.19,17.77 arc(34.32,17.64) 34.44,17.77 34.44,17.99 arc(34.57,18.12) 34.7,17.99 34.7,17.77 arc(34.83,17.64) 34.95,17.77 34.95,17.99 arc(34.99,18.08) 35.08,18.12 35.21,18.12 arc(35.3,18.08) 35.34,17.99 35.34,17.98 arc(35.47,17.85) 35.59,17.98 35.59,17.99 arc(35.63,18.08) 35.72,18.12 36.02,18.12 36.97,17.16 37.8,17.16 v1(38.39,16.57)
DDR_A7: length 32.7
  Top Layer w0.127: 42.77,16.98 42.4,16.6 41.64,16.6 41.3,16.94 41.3,19.55 39.39,21.46 34.82,21.46 34.09,20.73 33.61,20.73 arc(33.52,20.76) 33.48,20.85 33.48,21.45 arc(33.35,21.58) 33.23,21.45 33.23,20.85 arc(33.1,20.73) 32.97,20.85 32.97,21.45 arc(32.85,21.58) 32.72,21.45 32.72,20.85 arc(32.59,20.73) 32.47,20.85 32.47,21.45 arc(32.34,21.58) 32.21,21.45 32.21,20.85 arc(32.09,20.73) 31.96,20.85 31.96,21.45 arc(31.83,21.58) 31.7,21.45 31.7,20.85 arc(31.58,20.73) 31.45,20.85 31.45,21.24 arc(31.32,21.37) 31.2,21.24 31.2,20.85 arc(31.16,20.76) 31.07,20.73 26.88,20.73 23.07,16.92 23.07,16.49
DDR_A8: length 32.8
  Top Layer w0.127: v1(21.7,15.59) 21.7,15.12 21.7,15.11 ; 37.97,16.98 37.8,16.98 37.1,17.67 v1(36.99,17.67)
  Bottom Layer w0.127: v1(21.7,15.59) 22.15,16.04 22.66,16.04 25.48,18.86 25.83,18.86 arc(25.92,18.82) 25.96,18.73 25.96,18.56 arc(26.09,18.44) 26.21,18.56 26.21,18.73 arc(26.34,18.86) 26.47,18.73 26.47,18.56 arc(26.59,18.44) 26.72,18.56 26.72,18.73 arc(26.85,18.86) 26.97,18.73 26.97,18.56 arc(27.1,18.44) 27.23,18.56 27.23,18.73 arc(27.36,18.86) 27.48,18.73 27.48,18.56 arc(27.61,18.44) 27.74,18.56 27.74,18.73 arc(27.86,18.86) 27.99,18.73 27.99,18.56 arc(28.12,18.44) 28.24,18.56 28.24,18.73 arc(28.37,18.86) 28.5,18.73 28.5,18.56 arc(28.63,18.44) 28.75,18.56 28.75,18.73 arc(28.88,18.86) 29.01,18.73 29.01,18.56 arc(29.13,18.44) 29.26,18.56 29.26,18.73 arc(29.39,18.86) 29.51,18.73 29.51,18.56 arc(29.64,18.44) 29.77,18.56 29.77,18.73 arc(29.9,18.86) 30.02,18.73 30.02,18.56 arc(30.15,18.44) 30.28,18.56 30.28,18.73 arc(30.4,18.86) 30.53,18.73 30.53,18.56 arc(30.66,18.44) 30.78,18.56 30.78,18.73 arc(30.91,18.86) 31.04,18.73 31.04,18.56 arc(31.17,18.44) 31.29,18.56 31.29,18.73 arc(31.42,18.86) 31.55,18.73 31.55,18.56 arc(31.67,18.44) 31.8,18.56 31.8,18.73 arc(31.93,18.86) 32.05,18.73 32.05,18.56 arc(32.18,18.44) 32.31,18.56 32.31,18.73 arc(32.44,18.86) 32.56,18.73 32.56,18.56 arc(32.69,18.44) 32.82,18.56 32.82,18.73 arc(32.94,18.86) 33.07,18.73 33.07,18.56 arc(33.2,18.44) 33.32,18.56 33.32,18.73 arc(33.45,18.86) 33.58,18.73 33.58,18.56 arc(33.71,18.44) 33.83,18.56 33.83,18.73 arc(33.96,18.86) 34.09,18.73 34.09,18.56 arc(34.21,18.44) 34.34,18.56 34.34,18.73 arc(34.47,18.86) 34.59,18.73 34.59,18.56 arc(34.72,18.44) 34.85,18.56 34.85,18.73 arc(34.89,18.82) 34.98,18.86 35.1,18.86 arc(35.19,18.82) 35.23,18.73 35.23,18.72 arc(35.35,18.59) 35.48,18.72 35.48,18.73 arc(35.52,18.82) 35.61,18.86 35.8,18.86 35.97,18.7 arc(36.05,18.66) 36.14,18.7 36.44,18.99 arc(36.62,18.99) 36.62,18.81 36.32,18.52 arc(36.32,18.34) 36.5,18.34 36.8,18.64 arc(36.98,18.64) 36.98,18.46 36.68,18.16 arc(36.65,18.07) 36.68,17.98 v1(36.99,17.67)
DDR_A9: length 32.8
  Top Layer w0.127: 22.62,16.95 27.58,21.92 27.81,21.92 arc(27.9,21.88) 27.94,21.79 27.94,21.28 arc(28.06,21.15) 28.19,21.28 28.19,21.79 arc(28.32,21.92) 28.44,21.79 28.44,21.28 arc(28.57,21.15) 28.7,21.28 28.7,21.79 arc(28.82,21.92) 28.95,21.79 28.95,21.28 arc(29.08,21.15) 29.2,21.28 29.2,21.79 arc(29.33,21.92) 29.46,21.79 29.46,21.28 arc(29.59,21.15) 29.71,21.28 29.71,21.79 arc(29.84,21.92) 29.97,21.79 29.97,21.28 arc(30.09,21.15) 30.22,21.28 30.22,21.79 arc(30.35,21.92) 30.47,21.79 30.47,21.28 arc(30.6,21.15) 30.73,21.28 30.73,21.79 arc(30.77,21.88) 30.86,21.92 39.49,21.92 41.6,19.81 41.6,17.35 41.97,16.98
DDR_A10: length 32.7
  Top Layer w0.127: 42.77,15.38 42.82,15.38 43.22,15.78 ; v1(20.85,14.72) 20.85,14.27 20.78,14.19
  Bottom Layer w0.127: v1(20.85,14.72) 20.85,16.44 25.13,20.72 36.33,20.72 38.22,18.83 38.22,17.86 39.04,17.04 39.04,15.99 39.39,15.63 39.84,15.63 40.55,16.35 41.35,16.35 arc(41.44,16.38) 41.47,16.47 41.47,17.17 arc(41.6,17.29) 41.73,17.17 41.73,16.47 arc(41.77,16.38) 41.86,16.35 42.95,16.35 43.18,16.12 v1(43.18,15.74)
DDR_A11: length 32.8
  Top Layer w0.127: v1(37.39,18.02) 37.39,17.81 37.82,17.38 38.37,17.38 38.77,16.98 ; 22.16,16.49 22.61,16.49 v1(22.61,16.49)
  Bottom Layer w0.127: v1(37.39,18.02) 37.39,18.63 36.41,19.62 36.09,19.62 arc(36,19.58) 35.96,19.49 35.96,19.3 arc(35.84,19.17) 35.71,19.3 35.71,19.49 arc(35.58,19.62) 35.46,19.49 35.46,19.3 arc(35.33,19.17) 35.2,19.3 35.2,19.49 arc(35.08,19.62) 34.95,19.49 34.95,19.3 arc(34.82,19.17) 34.69,19.3 34.69,19.49 arc(34.57,19.62) 34.44,19.49 34.44,19.3 arc(34.31,19.17) 34.19,19.3 34.19,19.49 arc(34.06,19.62) 33.93,19.49 33.93,19.3 arc(33.81,19.17) 33.68,19.3 33.68,19.49 arc(33.55,19.62) 33.42,19.49 33.42,19.3 arc(33.3,19.17) 33.17,19.3 33.17,19.49 arc(33.04,19.62) 32.92,19.49 32.92,19.3 arc(32.79,19.17) 32.66,19.3 32.66,19.49 arc(32.54,19.62) 32.41,19.49 32.41,19.3 arc(32.28,19.17) 32.15,19.3 32.15,19.49 arc(32.03,19.62) 31.9,19.49 31.9,19.3 arc(31.77,19.17) 31.65,19.3 31.65,19.49 arc(31.52,19.62) 31.39,19.49 31.39,19.3 arc(31.27,19.17) 31.14,19.3 31.14,19.49 arc(31.01,19.62) 30.88,19.49 30.88,19.3 arc(30.76,19.17) 30.63,19.3 30.63,19.49 arc(30.5,19.62) 30.38,19.49 30.38,19.3 arc(30.25,19.17) 30.12,19.3 30.12,19.49 arc(30,19.62) 29.87,19.49 29.87,19.3 arc(29.74,19.17) 29.61,19.3 29.61,19.49 arc(29.49,19.62) 29.36,19.49 29.36,19.3 arc(29.23,19.17) 29.11,19.3 29.11,19.49 arc(28.98,19.62) 28.85,19.49 28.85,19.3 arc(28.73,19.17) 28.6,19.3 28.6,19.49 arc(28.47,19.62) 28.34,19.49 28.34,19.3 arc(28.22,19.17) 28.09,19.3 28.09,19.49 arc(27.96,19.62) 27.84,19.49 27.84,19.3 arc(27.71,19.17) 27.58,19.3 27.58,19.49 arc(27.46,19.62) 27.33,19.49 27.33,19.3 arc(27.2,19.17) 27.07,19.3 27.07,19.49 arc(26.95,19.62) 26.82,19.49 26.82,19.3 arc(26.69,19.17) 26.57,19.3 26.57,19.49 arc(26.44,19.62) 26.31,19.49 26.31,19.3 arc(26.19,19.17) 26.06,19.3 26.06,19.49 arc(26.02,19.58) 25.93,19.62 25.73,19.62 v1(22.61,16.49)
DDR_A12: length 32.7
  Top Layer w0.127: 42.77,17.78 42.77,20.11 42.69,20.19 arc(42.6,20.23) 42.51,20.19 42.22,19.9 arc(42.04,19.9) 42.04,20.08 42.33,20.37 arc(42.33,20.55) 42.15,20.55 41.86,20.26 arc(41.68,20.26) 41.68,20.44 41.97,20.73 arc(41.97,20.91) 41.79,20.91 41.5,20.62 arc(41.32,20.62) 41.32,20.8 41.61,21.09 arc(41.61,21.27) 41.43,21.27 41.14,20.98 arc(40.96,20.98) 40.96,21.16 41.25,21.45 arc(41.25,21.63) 41.07,21.63 40.78,21.34 arc(40.6,21.34) 40.6,21.52 40.89,21.81 arc(40.93,21.9) 40.89,21.99 40.58,22.3 27.52,22.3 21.71,16.49 21.71,16.05 21.7,16.03
DDR_A14_BA0: length 32.8
  Top Layer w0.127: v1(43.16,14.19) 43.16,14.19 42.77,14.58 ; v1(21.26,16.05) 21.26,15.59 21.24,15.57
  Bottom Layer w0.127: v1(21.26,16.05) 21.26,16.3 22.58,17.62 arc(22.67,17.66) 22.76,17.62 22.9,17.48 arc(23.08,17.48) 23.08,17.66 22.94,17.8 arc(22.94,17.98) 23.12,17.98 23.26,17.84 arc(23.44,17.84) 23.44,18.02 23.3,18.16 arc(23.3,18.34) 23.48,18.34 23.62,18.2 arc(23.8,18.2) 23.8,18.38 23.66,18.52 arc(23.66,18.7) 23.84,18.7 23.98,18.56 arc(24.16,18.56) 24.16,18.74 24.02,18.88 arc(24.02,19.06) 24.2,19.06 24.34,18.92 arc(24.52,18.92) 24.52,19.1 24.38,19.24 arc(24.38,19.42) 24.56,19.42 24.6,19.38 arc(24.78,19.38) 24.78,19.56 24.74,19.6 arc(24.7,19.69) 24.74,19.78 25.35,20.39 36.18,20.39 37.89,18.68 37.89,17.77 38.78,16.88 38.78,15.86 40.8,13.84 43.01,13.84 43.16,13.99 v1(43.16,14.19)
DDR_A15_BA1: length 32.8
  Top Layer w0.127: 41.97,14.58 42.38,14.99 43.51,14.99 44.18,15.66 44.18,19.2 40.64,22.74 27.03,22.74 21.71,17.42 21.71,16.97 21.7,16.95
DDR_CAS: length 32.8
  Top Layer w0.127: v1(24.87,15.45) 24.52,15.11 24.45,15.11 ; 38.77,14.58 38.73,14.58 38.39,14.92
  Bottom Layer w0.127: v1(38.39,14.92) 38.36,14.92 arc(38.27,14.88) 38.24,14.79 38.24,13.9 arc(38.11,13.78) 37.98,13.9 37.98,14.79 arc(37.95,14.88) 37.86,14.92 37.53,14.92 37.46,14.85 arc(37.37,14.81) 37.28,14.85 37.11,15.02 arc(36.93,15.02) 36.93,14.84 37.1,14.67 arc(37.14,14.58) 37.1,14.49 36.8,14.19 arc(36.71,14.15) 36.62,14.19 36.39,14.42 arc(36.21,14.42) 36.21,14.24 36.44,14.01 arc(36.48,13.92) 36.44,13.83 36.39,13.77 35.48,13.77 35.37,13.67 arc(35.28,13.63) 35.19,13.67 35.04,13.82 arc(34.86,13.82) 34.86,13.64 35.01,13.49 arc(35.05,13.4) 35.01,13.31 34.8,13.1 34.64,13.1 arc(34.55,13.14) 34.51,13.22 34.51,13.77 arc(34.39,13.9) 34.26,13.77 34.26,13.22 arc(34.13,13.1) 34,13.22 34,13.77 arc(33.88,13.9) 33.75,13.77 33.75,13.22 arc(33.62,13.1) 33.5,13.22 33.5,13.77 arc(33.37,13.9) 33.24,13.77 33.24,13.22 arc(33.12,13.1) 32.99,13.22 32.99,13.77 arc(32.86,13.9) 32.73,13.77 32.73,13.22 arc(32.61,13.1) 32.48,13.22 32.48,13.77 arc(32.35,13.9) 32.23,13.77 32.23,13.22 arc(32.1,13.1) 31.97,13.22 31.97,13.77 arc(31.85,13.9) 31.72,13.77 31.72,13.22 arc(31.59,13.1) 31.46,13.22 31.46,13.75 arc(31.34,13.87) 31.21,13.75 31.21,13.22 arc(31.08,13.1) 30.96,13.22 30.96,13.77 arc(30.83,13.9) 30.7,13.77 30.7,13.22 arc(30.67,13.14) 30.58,13.1 30.4,13.1 30.21,13.29 arc(30.17,13.38) 30.21,13.47 30.37,13.64 arc(30.37,13.82) 30.19,13.82 30.03,13.65 arc(29.94,13.62) 29.85,13.65 28.88,14.61 26.87,14.61 25.85,15.64 25.05,15.64 v1(24.87,15.45)
